# EasyEDA Pro project 工创赛底盘主控v3_2025-03-24.epro, board PCB2_1
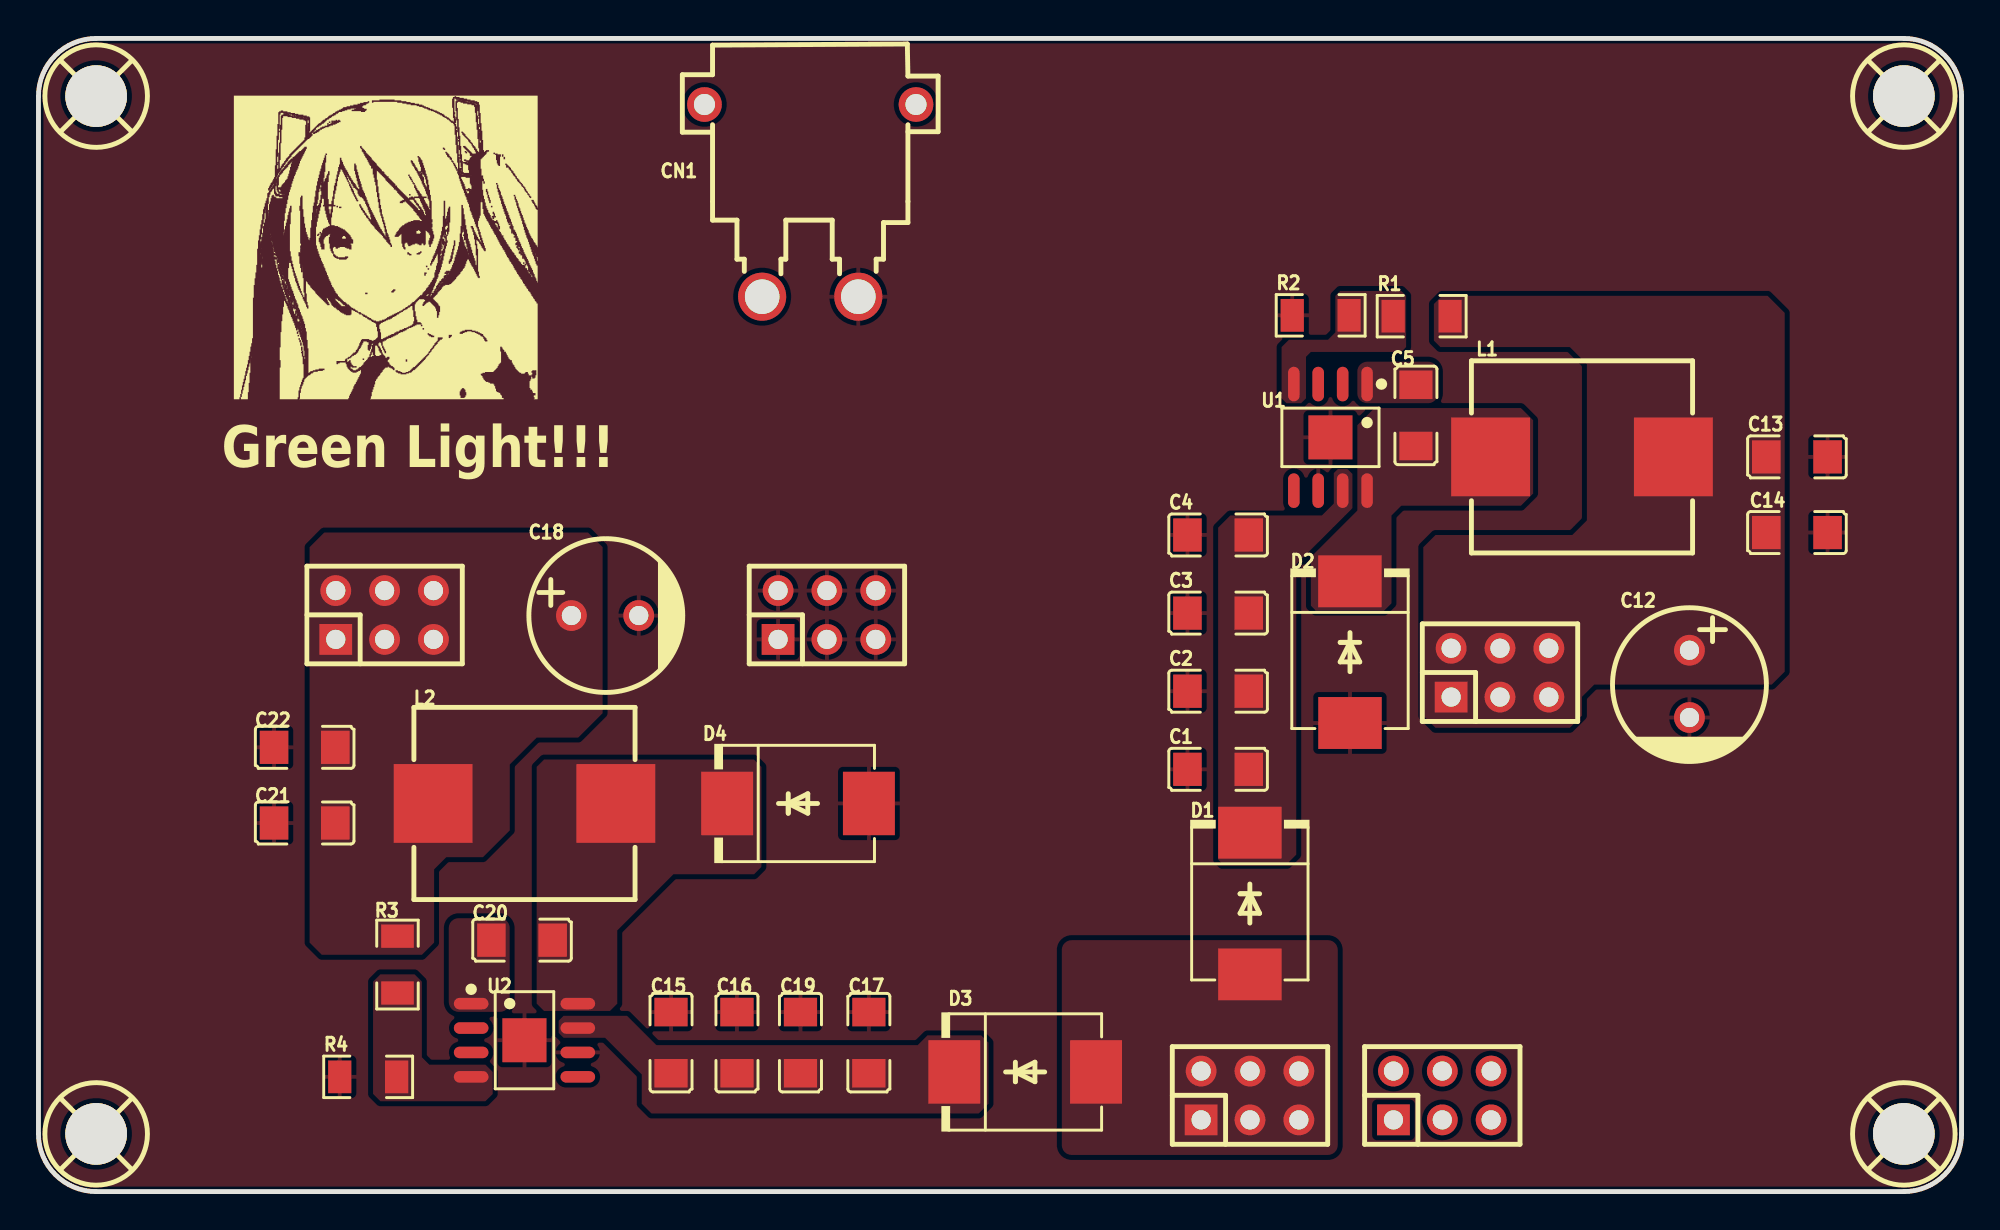
[diagram p5: board, top side]
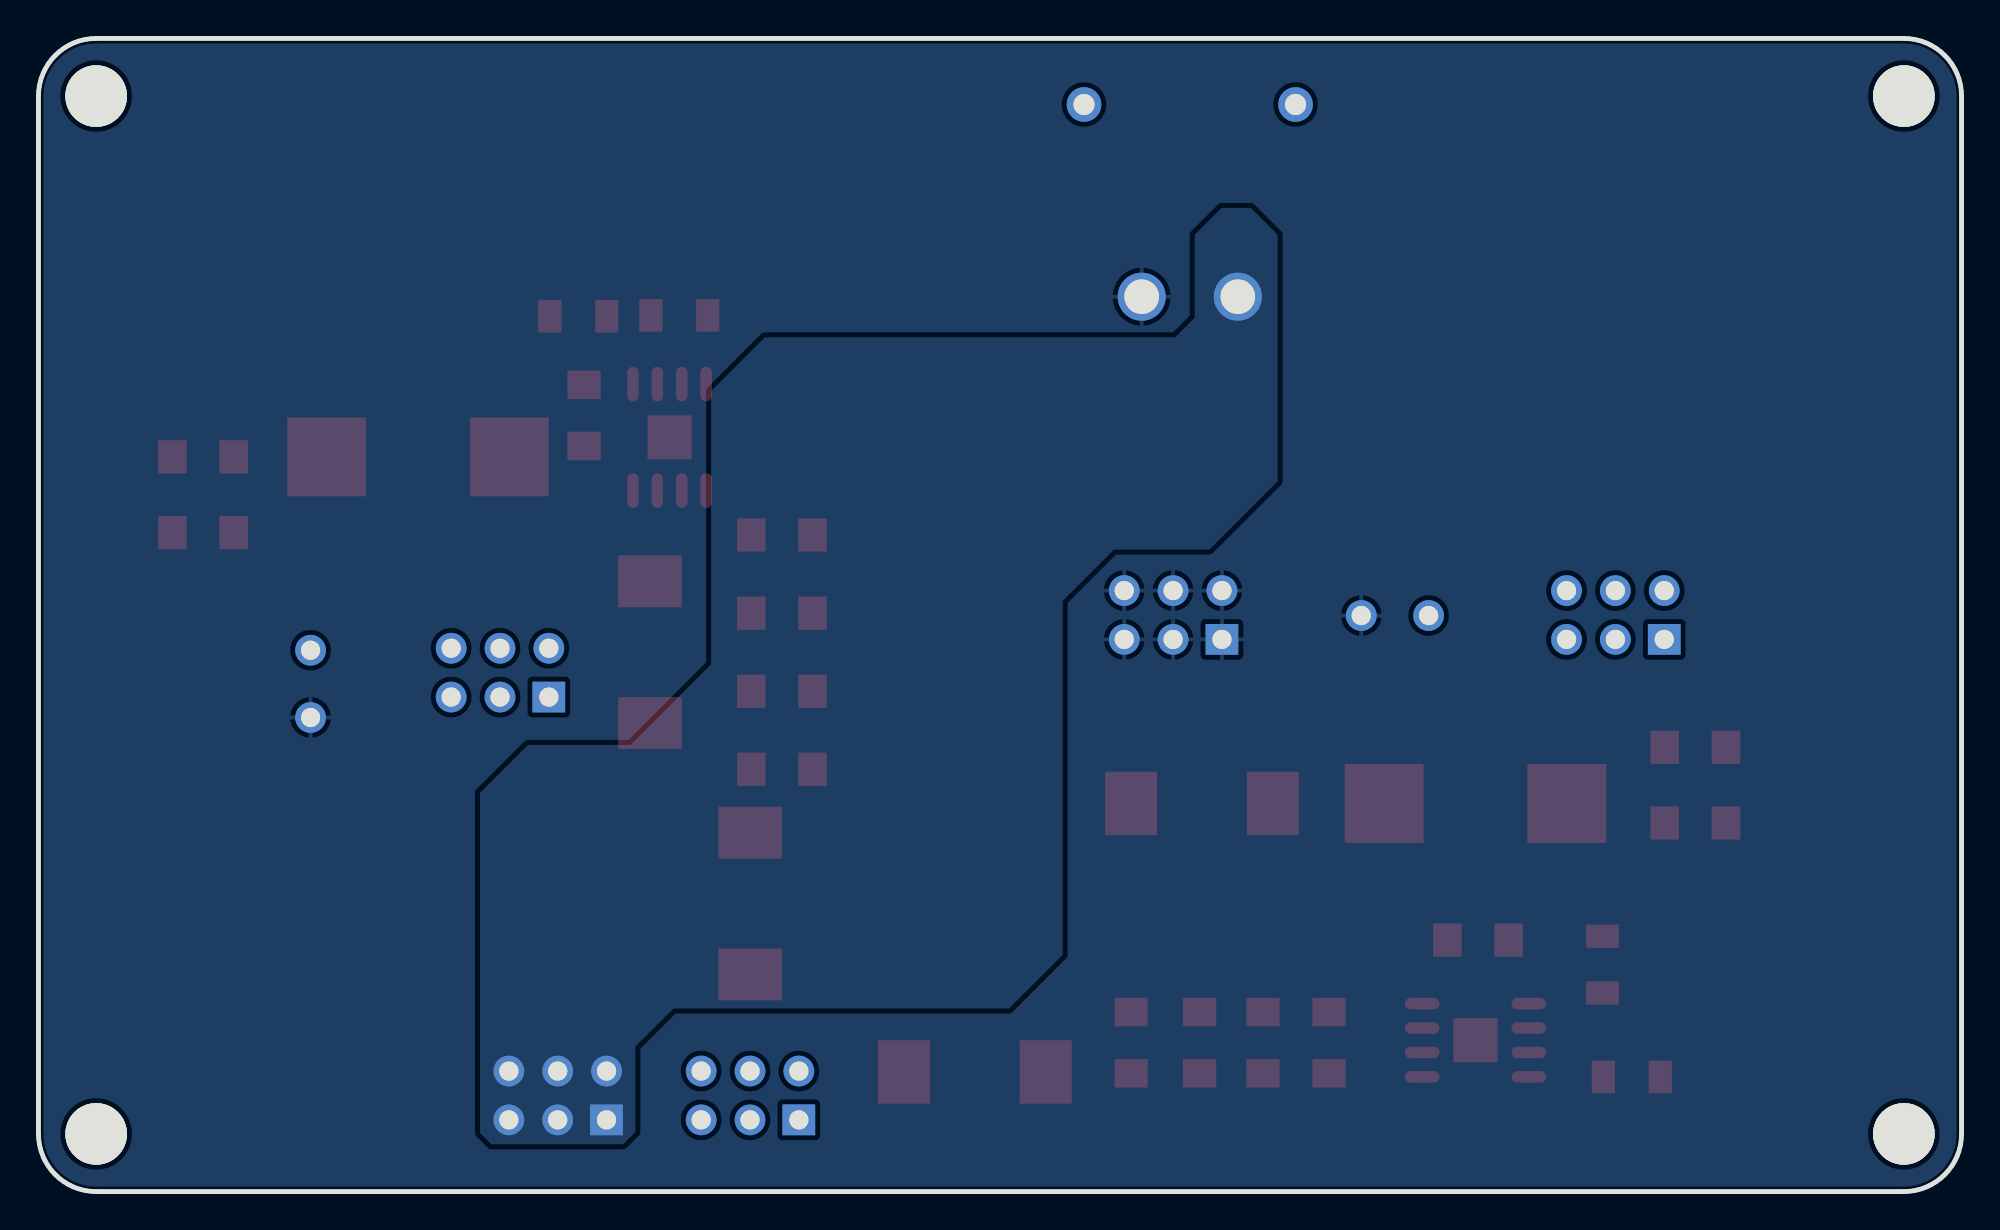
[diagram p6: board, bottom side, seen from below]

Outline 100 x 60 mm; copper layers: Top Layer, Bottom Layer. Coordinates in mm from the lower left corner of the outline.
Outline path: 0,57 0,3 arc(0.88,0.88) 3,0 97,0 arc(99.12,0.88) 100,3 100,57 arc(99.12,59.12) 97,60 3,60 arc(0.88,59.12) 0,57
Stack: Top Layer 0.035mm / Dielectric1 1.51mm FR4 er 4.5 / Bottom Layer 0.035mm

## Design rules (mm)
template: JLCPCB Capability(Two Layers Board)
spacing copperThickness1oz (default): track to track 0.102, other pairs 0.152 to 0.3
spacing copperThickness2oz: track to track 0.203, other pairs 0.152 to 0.3
track width copperThickness1oz (default): min 0.127, default 0.254, max 2.54
track width copperThickness2oz: min 0.203, default 0.254, max 2.54
differential pair differentialPair (default): width min 0.127, default 0.254, max 2.54; gap min 0.152, default 0.152
via viaSize (default): diameter min 0.5, default 0.61, max 10; hole min 0.3, default 0.305, max 6.3

## Placement (name value [footprint] x y rotation side)
C1  4.7uF  [C1206]  61.34 21.97 0 top
C2  4.7uF  [C1206]  61.34 26.03 0 top
C3  10nF  [C1206]  61.34 30.1 0 top
C4  1uF  [C1206]  61.34 34.16 0 top
C5  10nF  [C1206]  71.63 40.39 90 top
C12  330uF  [CAP-TH_BD8.0-P3.50-D0.6-FD]  85.85 26.42 270 top
C13  10nF  [C1206]  91.44 38.23 0 top
C14  1uF  [C1206]  91.44 34.29 180 top
C15  4.7uF  [C1206]  32.89 7.75 270 top
C16  4.7uF  [C1206]  36.32 7.75 270 top
C17  1uF  [C1206]  43.18 7.75 270 top
C18  330uF  [CAP-TH_BD8.0-P3.50-D0.6-FD]  29.46 29.97 0 top
C19  10nF  [C1206]  39.62 7.75 270 top
C20  10nF  [C1206]  25.15 13.08 180 top
C21  10nF  [C1206]  13.84 19.18 180 top
C22  1uF  [C1206]  13.84 23.11 0 top
CN1  XT30PW-M30.G.Y  [CONN-TH_XT30PW-M]  40.13 51.56 180 top
D1  SK1010C  [SMC_L6.9-W5.9-LS7.9-RD]  62.99 14.99 270 top
D2  SK1010C  [SMC_L6.9-W5.9-LS7.9-RD]  68.2 28.07 270 top
D3  SK1010C  [SMC_L6.9-W5.9-LS7.9-RD]  51.31 6.22 0 top
D4  SK1010C  [SMC_L6.9-W5.9-LS7.9-RD]  39.5 20.19 0 top
H1  PM254V-12-06-H85  [HDR-TH_6P-P2.54-V-F-R2-C3-S2.54]  73 5 0 top
H2  PM254V-12-06-H85  [HDR-TH_6P-P2.54-V-F-R2-C3-S2.54]  63 5 0 top
H4  PM254V-12-06-H85  [HDR-TH_6P-P2.54-V-F-R2-C3-S2.54]  76 27 0 top
H5  PM254V-12-06-H85  [HDR-TH_6P-P2.54-V-F-R2-C3-S2.54]  18 30 0 top
H6  PM254V-12-06-H85  [HDR-TH_6P-P2.54-V-F-R2-C3-S2.54]  41 30 0 top
L1  15uH  [IND-SMD_L11.5-W10.0_FXL1040]  80.26 38.23 0 top
L2  15uH  [IND-SMD_L11.5-W10.0_FXL1040]  25.27 20.19 180 top
R1  10kΩ  [R1206]  71.93 45.55 0 top
R2  698Ω  [R1206]  66.68 45.59 0 top
R3  10kΩ  [R1206]  18.67 11.81 90 top
R4  3.16kΩ  [R1206]  17.14 5.97 0 top
SCREW1  -  [M3螺丝]  3 57 0 top
SCREW2  -  [M3螺丝]  97 57 0 top
SCREW3  -  [M3螺丝]  3 3 0 top
SCREW4  -  [M3螺丝]  97 3 0 top
U1  TPS5450DDAR  [SOP-8_L4.9-W3.9-P1.27-LS6.0-BL-EP]  67.18 39.24 180 top
U2  TPS5450DDAR  [SOP-8_L4.9-W3.9-P1.27-LS6.0-BL-EP]  25.27 7.87 270 top

## Footprints (pads in the part's own frame, mm; a bottom-side part is the same pattern mirrored in y, then rotated)
C1206
  rect 1.485x1.728 smd: 1(-1.593,0) 2(1.593,0)
CAP-TH_BD8.0-P3.50-D0.6-FD
  round 1.6 hole 1: 1(-1.75,0) 2(1.75,0)
CONN-TH_XT30PW-M
  round 2.5 hole 1.8: 1(-2.5,5) 2(2.5,5)
  round 1.8 hole 1.1: 3(5.5,-5) 4(-5.5,-5)
HDR-TH_6P-P2.54-V-F-R2-C3-S2.54
  rect 1.7x1.6 hole 1: 1(-2.54,-1.27)
  round 1.6 hole 1: 2(-2.54,1.27) 3(0,-1.27) 4(0,1.27) 5(2.54,-1.27) 6(2.54,1.27)
IND-SMD_L11.5-W10.0_FXL1040
  rect 4.1x4.1 smd: 1(-4.75,0) 2(4.75,0)
M3螺丝
  round 3.2 hole 3.2: 1(0,0)
R1206
  rect 1.208x1.701 smd: 1(-1.479,0) 2(1.479,0)
SMC_L6.9-W5.9-LS7.9-RD
  rect 2.7x3.3 smd: 1(-3.687,0) 2(3.687,0)
SOP-8_L4.9-W3.9-P1.27-LS6.0-BL-EP
  oval 0.6x1.8 smd: 1(-1.905,-2.772) 2(-0.635,-2.772) 3(0.635,-2.772) 4(1.905,-2.772) 5(1.905,2.772) 6(0.635,2.772) 7(-0.635,2.772) 8(-1.905,2.772)
  rect 2.29x2.29 smd: 9(0,0)

## Nets
As in the schematic.

Pads without a net: CN1 3 4; SCREW1 1; SCREW2 1; SCREW3 1; SCREW4 1; U1 2 3 5; U2 2 3 5

## Copper pours and planes (outline as drawn; the poured copper is in the pictures)
24V_IN on Bottom Layer: 35.56,51.18 77.04,51.18 77.04,2.46 35.56,2.46
+24V on Top Layer: 53.21,13.08 67.56,13.08 67.56,1.91 53.21,1.91
GND on Top Layer: -4.95,65.66 105.03,65.66 105.03,-5.72 -4.95,-5.72
GND on Bottom Layer: -4.32,64.77 104.78,64.77 104.78,-6.1 -4.32,-6.1
VDD_5.0V on Top Layer: 14.1,34.29 29.34,34.29 29.34,12.32 14.1,12.32
VDD_19.0V on Top Layer: 72.01,46.61 90.81,46.61 90.81,24.13 72.01,24.13
$1N1659 on Top Layer: 61.34,37.59 68.33,37.59 68.33,17.06 61.34,17.06
$1N1662 on Top Layer: 68.58,43.18 72.77,43.18 72.77,41.02 68.58,41.02
$1N1663 on Top Layer: 66.17,40.77 77.72,40.77 77.72,30.23 66.17,30.23
$1N1670 on Top Layer: 64.64,46.86 71.12,46.86 71.12,41.02 64.64,41.02
$1N1672 on Top Layer: 27.05,9.14 49.4,9.14 49.4,4.06 27.05,4.06
$1N1675 on Top Layer: 21.34,14.22 24.5,14.22 24.5,9.35 21.34,9.35
$1N1676 on Top Layer: 25.91,22.48 37.59,22.48 37.59,9.4 25.91,9.4
$1N1683 on Top Layer: 17.4,11.3 23.62,11.3 23.62,4.7 17.4,4.7

## Text on the board
Top Silkscreen Layer: Green Light!!!
